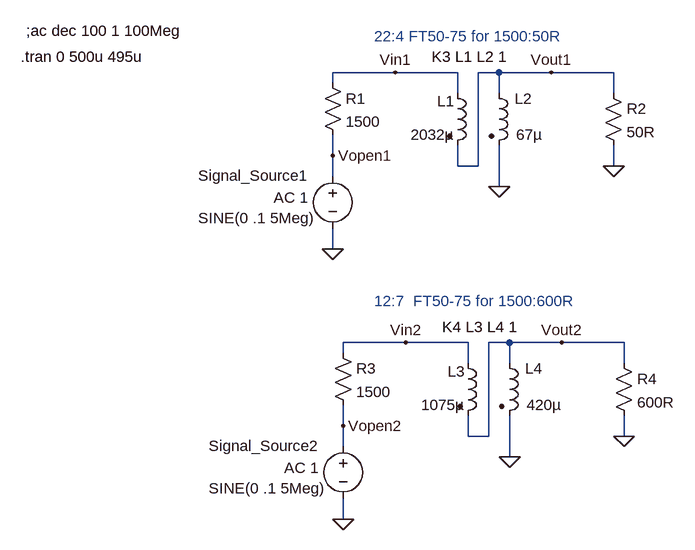
[diagram p0: schematic Impedance Matching Transformer.asc]
Impedance Matching Transformer.asc, the LTspice schematic file:
Version 4
SHEET 1 880 680
WIRE 48 -432 -48 -432
WIRE 144 -432 48 -432
WIRE 208 -432 176 -432
WIRE 288 -432 208 -432
WIRE 384 -432 288 -432
WIRE -48 -416 -48 -432
WIRE 144 -400 144 -432
WIRE 208 -400 208 -432
WIRE 384 -400 384 -432
WIRE -48 -304 -48 -336
WIRE 144 -288 144 -320
WIRE 176 -288 176 -432
WIRE 176 -288 144 -288
WIRE 384 -288 384 -320
WIRE -48 -272 -48 -304
WIRE 208 -256 208 -320
WIRE -48 -160 -48 -192
WIRE 64 -16 -32 -16
WIRE 160 -16 64 -16
WIRE 224 -16 192 -16
WIRE 304 -16 224 -16
WIRE 400 -16 304 -16
WIRE -32 0 -32 -16
WIRE 160 16 160 -16
WIRE 224 16 224 -16
WIRE 400 16 400 -16
WIRE -32 112 -32 80
WIRE 160 128 160 96
WIRE 192 128 192 -16
WIRE 192 128 160 128
WIRE 400 128 400 96
WIRE -32 144 -32 112
WIRE 224 160 224 96
WIRE -32 256 -32 224
FLAG -48 -160 0
FLAG -48 -304 Vopen1
FLAG 208 -256 0
FLAG 48 -432 Vin1
FLAG 288 -432 Vout1
FLAG 384 -288 0
FLAG -32 256 0
FLAG -32 112 Vopen2
FLAG 224 160 0
FLAG 64 -16 Vin2
FLAG 304 -16 Vout2
FLAG 400 128 0
SYMBOL voltage -48 -288 R0
WINDOW 3 -207 80 Left 2
WINDOW 123 -91 49 Left 2
WINDOW 39 0 0 Left 2
WINDOW 0 -207 15 Left 2
SYMATTR Value SINE(0 .1 5Meg)
SYMATTR Value2 AC 1
SYMATTR InstName Signal_Source1
SYMBOL res -64 -432 R0
SYMATTR InstName R1
SYMATTR Value 1500
SYMBOL ind2 128 -416 R0
WINDOW 0 -15 28 Left 2
WINDOW 3 -56 80 Left 2
SYMATTR InstName L1
SYMATTR Value 2032µ
SYMATTR Type ind
SYMBOL ind2 192 -416 R0
WINDOW 0 40 24 Left 2
WINDOW 3 42 80 Left 2
SYMATTR InstName L2
SYMATTR Value 67µ
SYMATTR Type ind
SYMBOL res 368 -416 R0
SYMATTR InstName R2
SYMATTR Value 50R
SYMBOL voltage -32 128 R0
WINDOW 3 -207 80 Left 2
WINDOW 123 -91 49 Left 2
WINDOW 39 0 0 Left 2
WINDOW 0 -207 15 Left 2
SYMATTR Value SINE(0 .1 5Meg)
SYMATTR Value2 AC 1
SYMATTR InstName Signal_Source2
SYMBOL res -48 -16 R0
SYMATTR InstName R3
SYMATTR Value 1500
SYMBOL ind2 144 0 R0
WINDOW 0 -15 28 Left 2
WINDOW 3 -56 80 Left 2
SYMATTR InstName L3
SYMATTR Value 1075µ
SYMATTR Type ind
SYMBOL ind2 208 0 R0
WINDOW 0 40 24 Left 2
WINDOW 3 42 80 Left 2
SYMATTR InstName L4
SYMATTR Value 420µ
SYMATTR Type ind
SYMBOL res 384 0 R0
SYMATTR InstName R4
SYMATTR Value 600R
TEXT 104 -456 Left 2 !K3 L1 L2 1
TEXT -520 -496 Left 2 !;ac dec 100 1 100Meg
TEXT -528 -456 Left 2 !.tran 0 500u 495u
TEXT 120 -40 Left 2 !K4 L3 L4 1
TEXT 16 -80 Left 2 ;12:7  FT50-75 for 1500:600R
TEXT 16 -488 Left 2 ;22:4 FT50-75 for 1500:50R

The netlist it stands for:
* Impedance Matching Transformer.asc
V§Signal_Source1 Vopen1 0 SINE(0 .1 5Meg) AC 1
R1 Vin1 Vopen1 1500
L1 Vin1 Vout1 2032µ
L2 Vout1 0 67µ
R2 Vout1 0 50R
V§Signal_Source2 Vopen2 0 SINE(0 .1 5Meg) AC 1
R3 Vin2 Vopen2 1500
L3 Vin2 Vout2 1075µ
L4 Vout2 0 420µ
R4 Vout2 0 600R
K3 L1 L2 1
;ac dec 100 1 100Meg
.tran 0 500u 495u
K4 L3 L4 1
* 12:7  FT50-75 for 1500:600R
* 22:4 FT50-75 for 1500:50R
.backanno
.end